# EAGLE design pm-batt-ti (EAGLE 6.4)

## Sheet 1 of 2
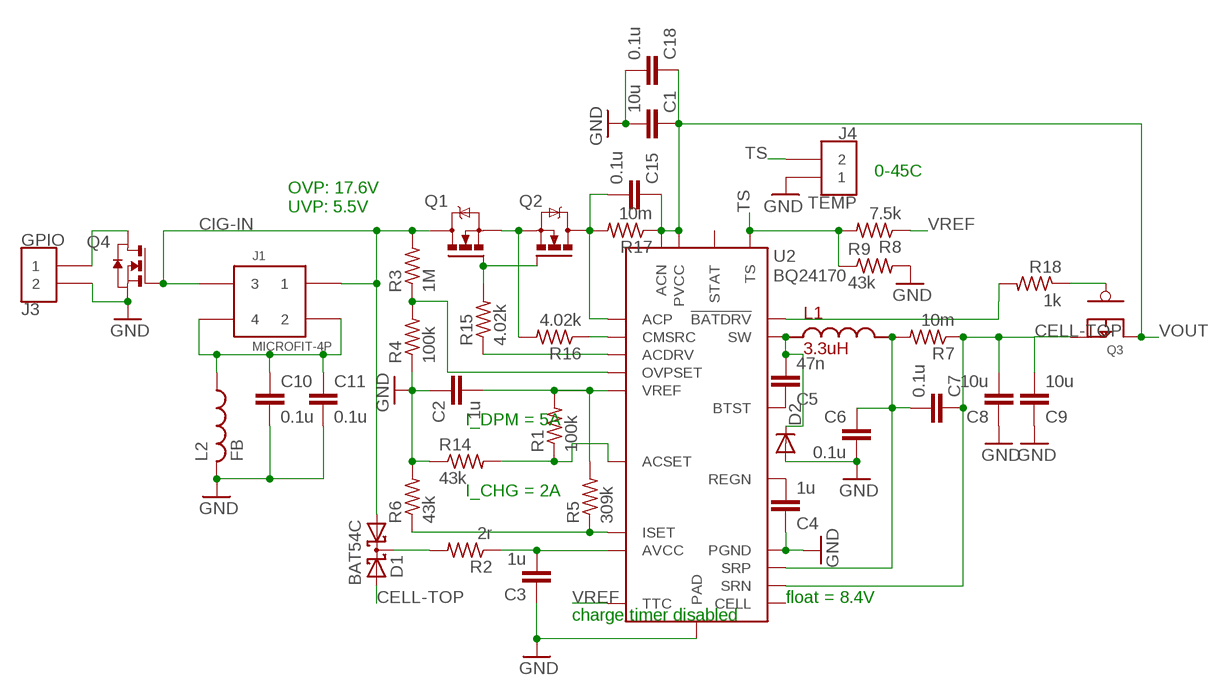
[diagram p0: schematic, sheet 1]

### Parts
C1  10u  C-EUC1206  [C1206]
C2  1u  C-EUC0603  [C0603]
C3  1u  C-EUC0603  [C0603]
C4  1u  C-EUC0603  [C0603]
C5  47n  C-EUC0603  [C0603]
C6  0.1u  C-EUC0603  [C0603]
C7  0.1u  C-EUC0603  [C0603]
C8  10u  C-EUC0805  [C0805]
C9  10u  C-EUC0805  [C0805]
C10  0.1u  C-EUC0603  [C0603]
C11  0.1u  C-EUC0603  [C0603]
C15  0.1u  C-EUC0603  [C0603]
C18  0.1u  C-EUC0603  [C0603]
D1  BAT54C  [SOT23]
D2  DIODESMA-ALT  [SMA-DIODE_ALT]
J1  MICROFIT-4P  [MICROFIT-4P]
J3  GPIO  MICROFIT-2P-RAPTH  [MICROFIT-2P]
J4  TEMP  MICROFIT-2P-RAPTH  [MICROFIT-2P]
L1  3.3uH  INDUCTORSVISHAY  [L-VISHAY-IHLP2020CZ01]
L2  FB  L-USL3216C  [L3216C]
Q1  FDB047N10  [D2_PAK]
Q2  FDB047N10  [D2_PAK]
Q3  SUM110P  [D2_PAK]
Q4  NMOSSOT23  [SOT-23]
R1  100k  R-US_R0603  [R0603]
R2  2r  R-US_R0603  [R0603]
R3  1M  R-US_R0603  [R0603]
R4  100k  R-US_R0603  [R0603]
R5  309k  R-US_R0603  [R0603]
R6  43k  R-US_R0603  [R0603]
R7  10m  R-US_R0805  [R0805]
R8  7.5k  R-US_R0603  [R0603]
R9  43k  R-US_R0603  [R0603]
R14  43k  R-US_R0603  [R0603]
R15  4.02k  R-US_R0603  [R0603]
R16  4.02k  R-US_R0603  [R0603]
R17  10m  R-US_R0805  [R0805]
R18  1k  R-US_R0603  [R0603]
U2  BQ24170  [QFN-24-TP]

### Nets
CELL-TOP: C7.1 C8.2 C9.2 D1.2(A2) Q3.3(S3) R7.1 U2.15(SRN) ; also sheet 2
CIG-IN: D1.1(A1) J1.1 J1.3 Q1.4(D) Q4.3(G) R3.2
GND: C1.2 C2.1 C3.1 C4.1 C6.2 C8.1 C9.1 C10.2 C11.2 C18.2 D2.A J3.P$2 J4.P$1 L2.2 Q4.2(S) R4.1 R6.2 R9.2 R14.1 U2.22(PGND) U2.23(PGND) U2.TP(PAD) ; also sheet 2
N$1: C15.2 Q2.4(D) R17.2 U2.6(ACP)
N$2: R3.1 R4.2 U2.18(OVPSET)
N$3: R1.1 R14.2 U2.17(ACSET)
N$5: C3.2 R2.1 U2.4(AVCC)
N$6: R5.1 R6.1 U2.13(ISET)
N$7: C4.2 U2.20(REGN)
N$8: C5.2 D2.C L1.P$1 U2.1(SW) U2.24(SW)
N$9: C5.1 U2.21(BTST)
N$10: C6.1 C7.2 L1.P$2 R7.2 U2.16(SRP)
N$11: D1.3(CC) R2.2
N$19: R18.2 U2.19(!BATDRV)
N$20: Q1.3(S) Q2.3(S) R16.2
N$21: Q3.1(G4) R18.1
N$24: Q1.1(G) Q2.1(G) R15.2
N$26: R15.1 U2.8(ACDRV)
N$27: R16.1 U2.7(CMSRC)
N$28: J3.P$1 Q4.1(D)
SHLD: C10.1 C11.1 J1.2 J1.4 L2.1
TS: J4.P$2 R8.2 R9.1 U2.10(TS)
VOUT: C1.1 C15.1 C18.1 Q3.4(D8) R17.1 U2.2(PVCC) U2.3(PVCC) U2.5(ACN) ; also sheet 2
VREF: C2.2 R1.2 R5.2 R8.1 U2.11(TTC) U2.12(VREF)
Unconnected: U2.9(STAT) U2.14(CELL)

### Notes on the sheet
- 0-45C
- OVP: 17.6V
  UVP: 5.5V
- I_DPM = 5A
- I_CHG = 2A
- float = 8.4V
- charge timer disabled

## Sheet 2 of 2
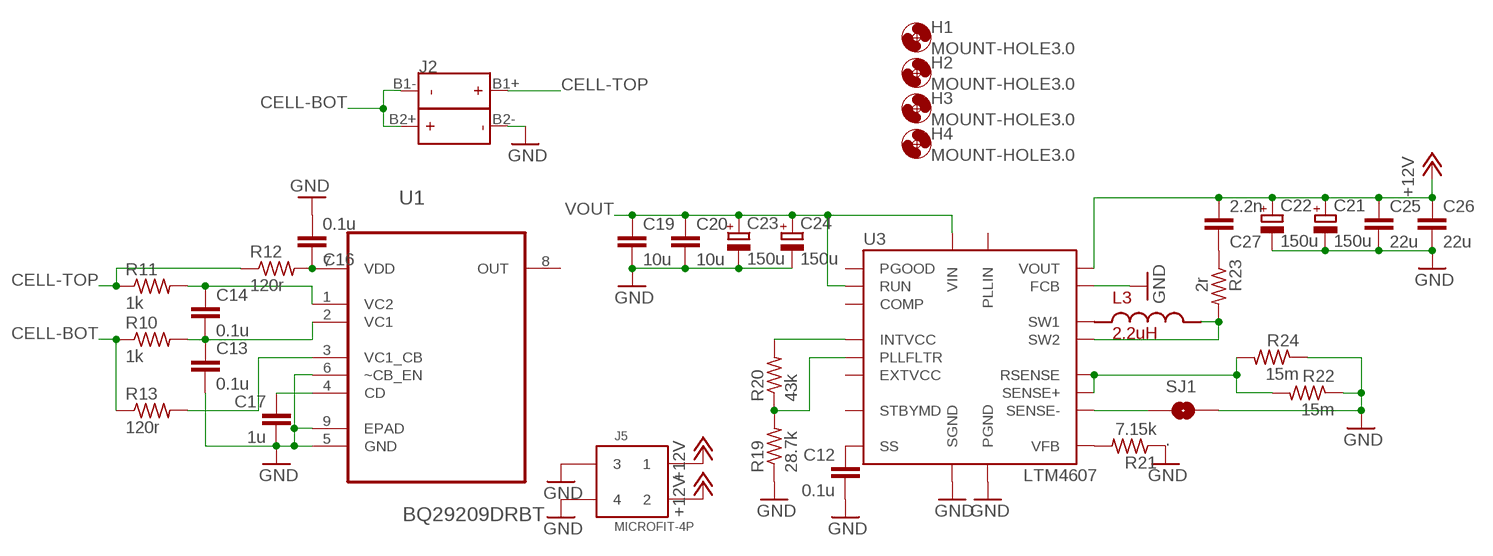
[diagram p1: schematic, sheet 2]

### Parts
C12  0.1u  C-EUC0805  [C0805]
C13  0.1u  C-EUC0603  [C0603]
C14  0.1u  C-EUC0603  [C0603]
C16  0.1u  C-EUC0603  [C0603]
C17  1u  C-EUC0603  [C0603]
C19  10u  C-EUC1206  [C1206]
C20  10u  C-EUC1206  [C1206]
C21  150u  CAP2917  [C2917]
C22  150u  CAP2917  [C2917]
C23  150u  CAP2917  [C2917]
C24  150u  CAP2917  [C2917]
C25  22u  C-EUC1206  [C1206]
C26  22u  C-EUC1206  [C1206]
C27  2.2n  C-EUC0603  [C0603]
H1  MOUNT-HOLE3.0  [3,0]
H2  MOUNT-HOLE3.0  [3,0]
H3  MOUNT-HOLE3.0  [3,0]
H4  MOUNT-HOLE3.0  [3,0]
J2  18650X2  [K1048]
J5  MICROFIT-4P  [MICROFIT-4P]
L3  2.2uH  INDUCTORSVISHAY  [L-VISHAY-IHLP2020CZ01]
R10  1k  R-US_R0603  [R0603]
R11  1k  R-US_R0603  [R0603]
R12  120r  R-US_R0603  [R0603]
R13  120r  R-US_R0603  [R0603]
R19  28.7k  R-US_R0603  [R0603]
R20  43k  R-US_R0603  [R0603]
R21  7.15k  R-US_R0603  [R0603]
R22  15m  R-US_R0805  [R0805@1]
R23  2r  R-US_R0603  [R0603]
R24  15m  R-US_R0805  [R0805@1]
SJ1  .  SOLDERJUMPERTRACE  [SJ_2S-TRACE]
U1  BQ29209DRBT  [SON65P315X315X100-9N]
U3  LTM4607  [LTM4607]

### Nets
+12V: C21.+ C22.+ C25.1 C26.1 C27.2 J5.1 J5.2 U3.E1(VOUT) U3.E2(VOUT) U3.F1(VOUT) U3.F2(VOUT) U3.F3(VOUT) U3.F4(VOUT) U3.G1(VOUT) U3.G2(VOUT) U3.G3(VOUT) U3.G4(VOUT) U3.H1(VOUT) U3.H2(VOUT) U3.H3(VOUT) U3.H4(VOUT)
CELL-BOT: J2.B1- J2.B2+ R10.1 R13.1
CELL-TOP: J2.B1+ R11.1 R12.1 ; also sheet 1
GND: C12.2 C13.2 C16.2 C17.2 C19.2 C20.2 C21.- C22.- C23.- C24.- C25.2 C26.2 J2.B2- J5.3 J5.4 R19.1 R21.1 R22.1 R24.1 SJ1.2 U1.5(GND) U1.6(~CB_EN) U1.9(EPAD) U3.A1(PGND) U3.A2(PGND) U3.A3(PGND) U3.A7(SGND) U3.A9(FCB) U3.A11(PGND) U3.A12(PGND) U3.B1(PGND) U3.B2(PGND) U3.B3(PGND) U3.B4(PGND) U3.B10(PGND) U3.B11(PGND) U3.B12(PGND) U3.C1(PGND) U3.C2(PGND) U3.C3(PGND) U3.C4(PGND) U3.C5(PGND) U3.C6(PGND) U3.C7(PGND) U3.C8(PGND) U3.C9(PGND) U3.C10(PGND) U3.C11(PGND) U3.C12(PGND) U3.D1(PGND) U3.D2(PGND) U3.D3(PGND) U3.D4(PGND) U3.D5(PGND) U3.D6(PGND) U3.D7(PGND) U3.D8(PGND) U3.D9(PGND) U3.D10(PGND) U3.D11(PGND) U3.D12(PGND) U3.E3(PGND) U3.E4(PGND) U3.E5(PGND) U3.E6(PGND) U3.E7(PGND) U3.E8(PGND) U3.E9(PGND) U3.E10(PGND) U3.E11(PGND) U3.E12(PGND) ; also sheet 1
N$4: C17.1 U1.4(CD)
N$12: R19.2 R20.1 U3.B8(PLLFLTR)
N$13: L3.P$1 U3.J1(SW1) U3.J2(SW1) U3.J3(SW1) U3.J4(SW1) U3.K1(SW1) U3.K2(SW1) U3.K3(SW1) U3.K4(SW1) U3.L1(SW1) U3.L2(SW1) U3.L3(SW1) U3.L4(SW1) U3.M1(SW1) U3.M2(SW1) U3.M3(SW1) U3.M4(SW1)
N$14: C13.1 C14.2 R10.2 U1.2(VC1)
N$15: C14.1 R11.2 U1.1(VC2)
N$16: R20.2 U3.F5(INTVCC)
N$17: C16.1 R12.2 U1.7(VDD)
N$18: R13.2 U1.3(VC1_CB)
N$22: C12.1 U3.A6(SS)
N$23: R21.2 U3.B6(VFB)
N$25: C27.1 R23.1
N$34: SJ1.1 U3.A5(SENSE-)
RSENSE: R22.2 R24.2 U3.A4(SENSE+) U3.F10(RSENSE) U3.F11(RSENSE) U3.F12(RSENSE) U3.G5(RSENSE) U3.G6(RSENSE) U3.G7(RSENSE) U3.G8(RSENSE) U3.G9(RSENSE) U3.G10(RSENSE) U3.G11(RSENSE) U3.G12(RSENSE) U3.H5(RSENSE) U3.H6(RSENSE) U3.H7(RSENSE) U3.H8(RSENSE) U3.H9(RSENSE) U3.H10(RSENSE) U3.H11(RSENSE) U3.H12(RSENSE) U3.J5(RSENSE) U3.J6(RSENSE) U3.J7(RSENSE) U3.K5(RSENSE) U3.K6(RSENSE) U3.L5(RSENSE) U3.L6(RSENSE) U3.M5(RSENSE) U3.M6(RSENSE)
SW2: L3.P$2 R23.2 U3.J8(SW2) U3.J9(SW2) U3.K7(SW2) U3.K8(SW2) U3.K9(SW2) U3.L7(SW2) U3.L8(SW2) U3.L9(SW2) U3.M7(SW2) U3.M8(SW2) U3.M9(SW2)
VOUT: C19.1 C20.1 C23.+ C24.+ U3.A8(RUN) U3.J10(VIN) U3.J11(VIN) U3.J12(VIN) U3.K10(VIN) U3.K11(VIN) U3.K12(VIN) U3.L10(VIN) U3.L11(VIN) U3.L12(VIN) U3.M10(VIN) U3.M11(VIN) U3.M12(VIN) ; also sheet 1
Unconnected: U1.8(OUT) U3.A10(STBYMD) U3.B5(PGOOD) U3.B7(COMP) U3.B9(PLLIN) U3.F6(EXTVCC)

## Library data of the parts
C1-C11 C13-C20 C25-C27 = rcl:C-EU: CAPACITOR, European symbol
C12 = resistor:C-EU: CAPACITOR, European symbol
C21-C24 = Neel:CAP
D1 = diode:BAT54C: Schottky Diodes Source: Fairchild .. BAT54.pdf
D2 = SparkFun-DiscreteSemi:DIODE: Diode These are standard reverse protection diodes and small signal diodes. SMA package can handle up to about 1A. SOD-323 can handle about 200mA. What the SOD-323 package when ordering, there are some mfgs out there that are 5-pin packages.
H1-H4 = holes:MOUNT-HOLE: MOUNTING HOLE with drill center marker
J1 J5 = earthmine:MICROFIT-4P: Molex Micro-Fit 3.0 Vertical Header - 4 Position
J2 = Neel:18650X2
J3 J4 = earthmine:MICROFIT-2P-RA: Molex Microfit 3.0 Series - 2P Right Angle Header
L1 L3 = Neel:INDUCTORS
L2 = rcl:L-US: INDUCTOR, American symbol
Q1 Q2 = earthmine:FDB047N10: N-Channel PowerTrench MOSFET
Q3 = earthmine:SUM110P
Q4 = zetex:NMOSSOT23: MOS FET; OC_FARNELL: unknown; OC_NEWARK: unknown
R1-R21 R23 = resistor:R-US_: RESISTOR, American symbol
R22 R24 = rcl:R-US_: RESISTOR, American symbol
SJ1 = SparkFun-Passives:SOLDERJUMPER: Solder Jumper Standard SMD solder jumper. Used to automate production. Two varients : Normally Open and Normally Closed are the same, but have different paste layers. NC will have a large amount of paste and should jumper during reflow.
U1 = Texas Instruments_By_element14_Batch_1:BQ29209DRBT: Voltage Protection with Automatic Cell Balance for 2-Series Cell Li-Ion Batteries; MPN: BQ29209DRBT; OC_FARNELL: -; OC_NEWARK: 83R9422; PACKAGE: SON-8; SUPPLIER: Texas Instruments
U2 = Neel:BQ24170
U3 = earthmine:LTM4607

## Board
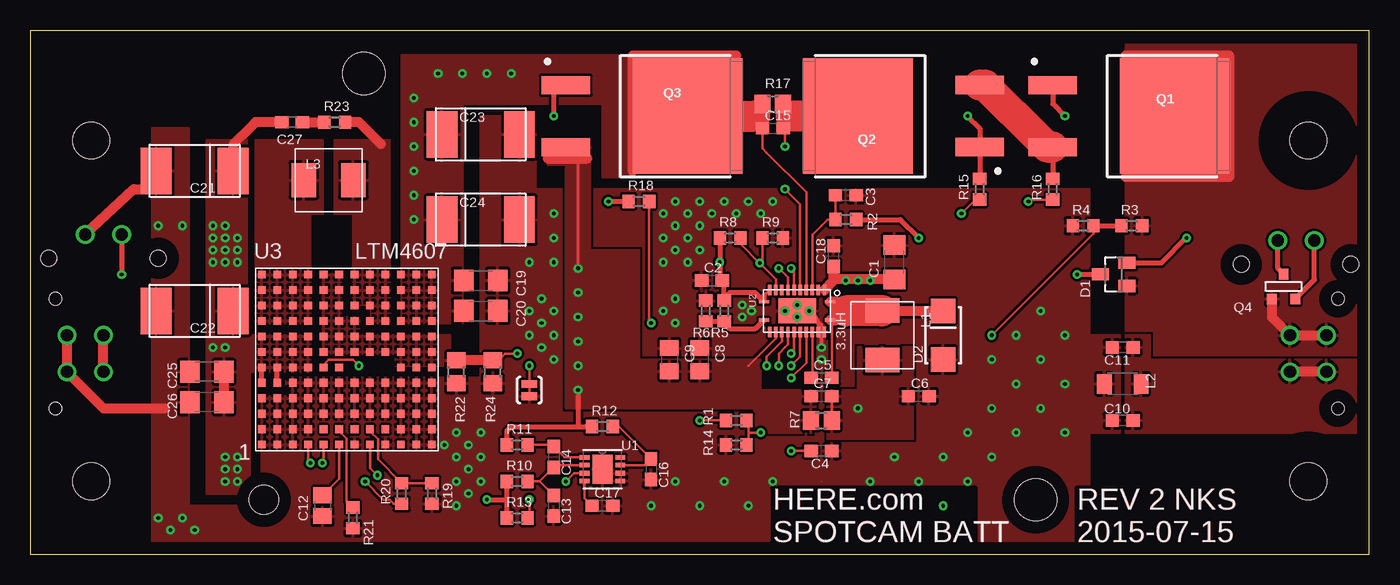
[diagram p2: board, top side]
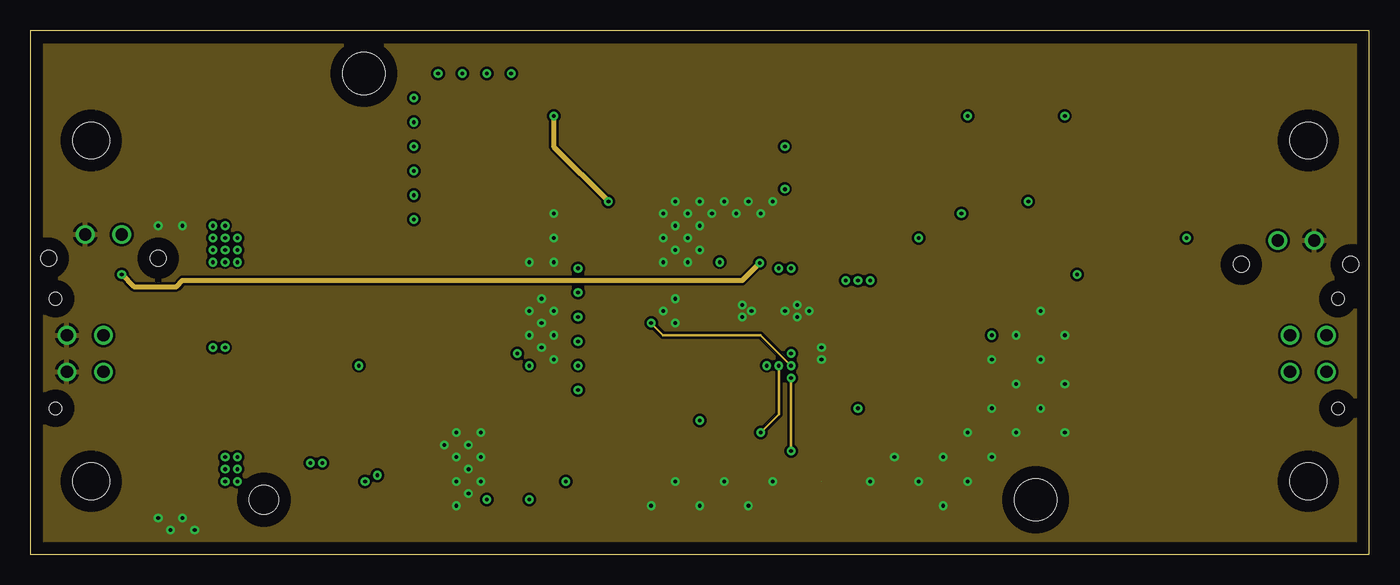
[diagram p3: board, inner layer Route2]
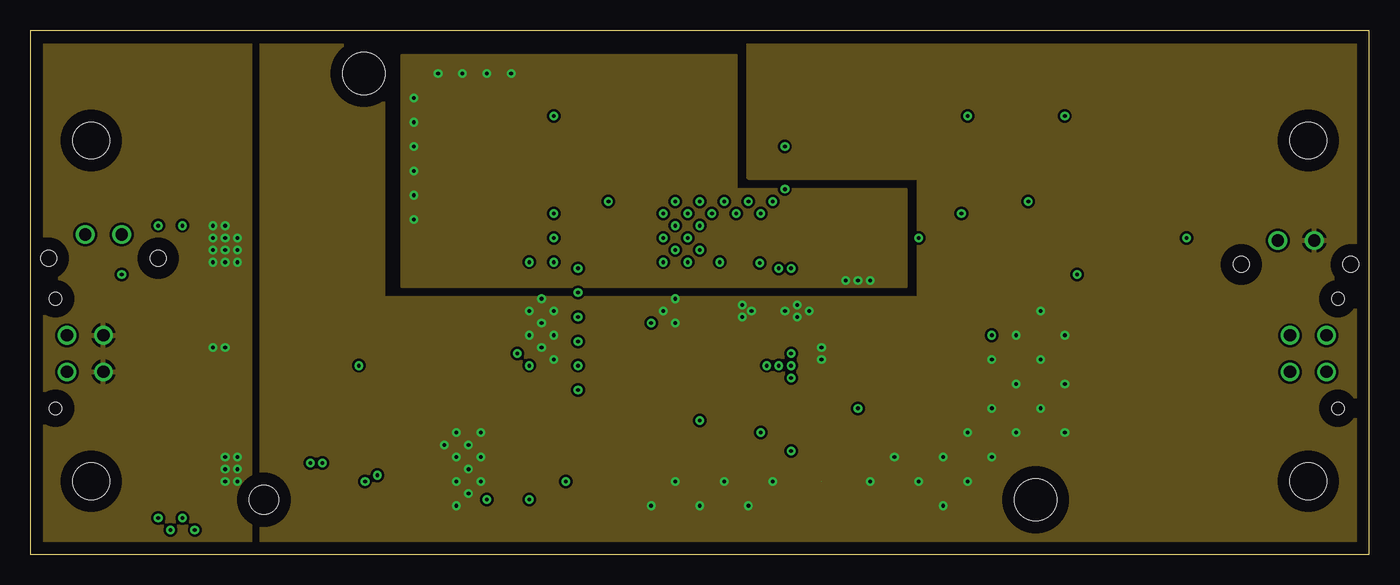
[diagram p4: board, inner layer Route15]
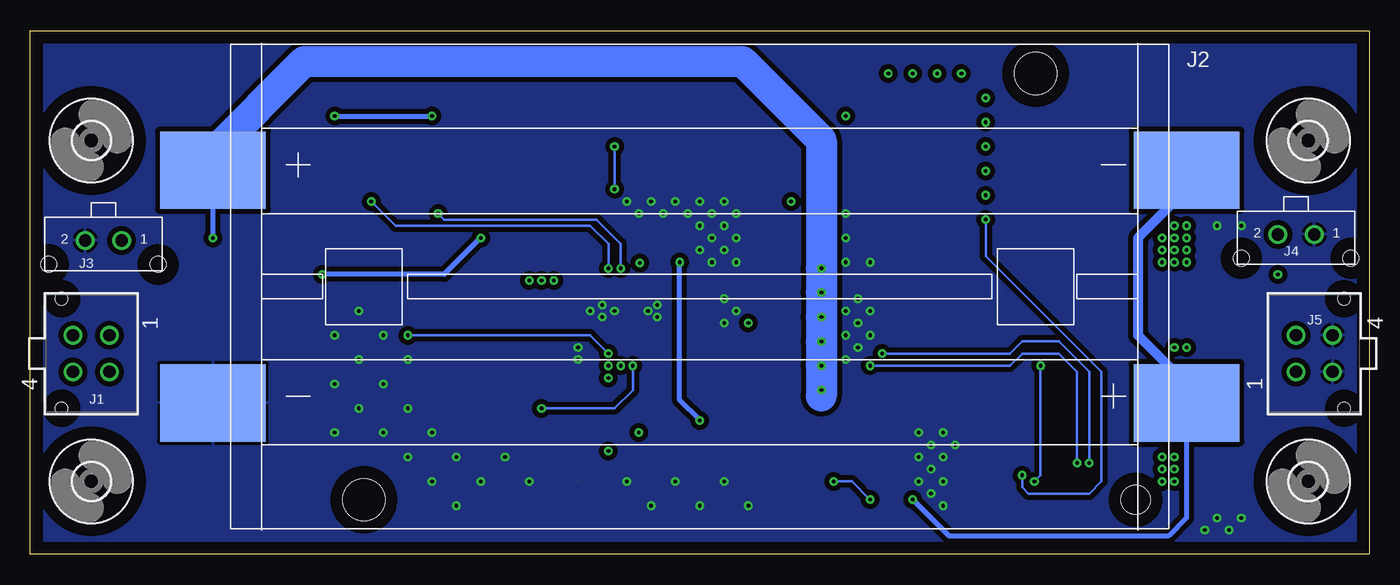
[diagram p5: board, bottom side, seen from below]

Size 110 x 43 mm. Coordinates in mm from the lower left corner, seen from the top.
Outline: 0,0 110,0 110,43 0,43 0,0
Copper layers (1+2*15+16): Top 0.07mm / dielectric 0.7mm / Route2 0.07mm / dielectric 0.7mm / Route15 0.07mm / dielectric 0.7mm / Bottom 0.07mm
Design rules "default *": minimum track width 5mil, minimum drill 8mil, track to track 8mil, track to pad 8mil, pad to pad 8mil, via to via 8mil, smd to smd 8mil, copper to edge 40mil, drill to drill 8mil, minimum pad ring 10mil, minimum via ring 8mil, stop-mask expansion 4mil, vias tented up to drill 0mil, thermal gap 10mil

### Footprints (pad centres in the part's own frame; a part is rotated, then mirrored left to right if it is on the bottom)
C1206 = smd 1.6 x 1.8: 1 -1.4,0; 2 1.4,0
C0603 = smd 1.1 x 1: 1 -0.85,0; 2 0.85,0
C0805 = smd 1.3 x 1.5: 1 -0.95,0; 2 0.95,0
C0805' = smd 1.3 x 1.5: 1 -0.85,0; 2 0.85,0
C2917 = smd 2.54 x 3.81: + -3.175,0; - 3.175,0
SOT23 = smd 1 x 1.4: 1 -0.95,-1.1; 2 0.95,-1.1; 3 0,1.1
SMA-DIODE_ALT = smd 2 x 2: A -2,0; C 2,0
3,0 = hole 3: 0,0
MICROFIT-4P = drill 1.016: 1 1.5,-1.5; 2 -1.5,-1.5; 3 1.5,1.5; 4 -1.5,1.5 | hole 1.016: -4.5,2.44; 4.5,2.44
K1048 = smd 8.68 x 6.35: B1+ -40,9.555; B1- 40,9.555; B2+ 40,-9.555; B2- -40,-9.555 | hole 3.45: -27.6,-17.505; 27.6,17.505 | hole 2.39: 35.82,-17.505
MICROFIT-2P = drill 1.02: P$1 1.5,0.285; P$2 -1.5,0.285 | hole 1.3: 4.5,-1.675; -4.5,-1.675
L-VISHAY-IHLP2020CZ01 = smd 2.032 x 2.794: P$1 -2.032,0; P$2 2.032,0
L3216C = smd 1.2 x 1.6: 1 -1.5,0; 2 1.5,0
D2_PAK = smd 1.5 x 4: 1 -2.54,-10; 3 2.55,-10 | smd 9.5 x 9: 4 0,0
SOT-23 = smd 0.787 x 0.889: 1 0.025,-1.016; 2 -0.94,1.016; 3 0.991,1.016
R0603 = smd 1 x 1.1: 1 -0.85,0; 2 0.85,0
R0805 = smd 1.3 x 1.5: 1 -0.85,0; 2 0.85,0
R0805' = smd 1.3 x 1.5: 1 -0.95,0; 2 0.95,0
SJ_2S-TRACE = smd 0.635 x 1.27: 1 -0.508,0; 2 0.508,0
SON65P315X315X100-9N = smd 0.813 x 0.381: 1 -1.473,0.965; 2 -1.473,0.33; 3 -1.473,-0.33; 4 -1.473,-0.965; 5 1.473,-0.965; 6 1.473,-0.33; 7 1.473,0.33; 8 1.473,0.965 | smd 1.651 x 2.388: 9 0,0
QFN-24-TP = smd 0.85 x 0.28: 1 -2.725,-0.75; 12 2.725,-0.75; 13 2.725,0.75; 24 -2.725,0.75 | smd 0.28 x 0.85: 2 -2.25,-1.725; 3 -1.75,-1.725; 4 -1.25,-1.725; 5 -0.75,-1.725; 6 -0.25,-1.725; 7 0.25,-1.725; 8 0.75,-1.725; 9 1.25,-1.725; 10 1.75,-1.725; 11 2.25,-1.725; 14 2.25,1.725; 15 1.75,1.725; 16 1.25,1.725; 17 0.75,1.725; 18 0.25,1.725; 19 -0.25,1.725; 20 -0.75,1.725; 21 -1.25,1.725; 22 -1.75,1.725; 23 -2.25,1.725 | smd 3.1 x 2.05: TP 0,0
LTM4607 = smd 0.63 x 0.63: A1 -6.985,-6.985; A2 -5.715,-6.985; A3 -4.445,-6.985; A4 -3.175,-6.985; A5 -1.905,-6.985; A6 -0.635,-6.985; A7 0.635,-6.985; A8 1.905,-6.985; A9 3.175,-6.985; A10 4.445,-6.985; A11 5.715,-6.985; A12 6.985,-6.985; B1 -6.985,-5.715; B2 -5.715,-5.715; B3 -4.445,-5.715; B4 -3.175,-5.715; B5 -1.905,-5.715; B6 -0.635,-5.715; B7 0.635,-5.715; B8 1.905,-5.715; B9 3.175,-5.715; B10 4.445,-5.715; B11 5.715,-5.715; B12 6.985,-5.715; C1 -6.985,-4.445; C2 -5.715,-4.445; C3 -4.445,-4.445; C4 -3.175,-4.445; C5 -1.905,-4.445; C6 -0.635,-4.445; C7 0.635,-4.445; C8 1.905,-4.445; C9 3.175,-4.445; C10 4.445,-4.445; C11 5.715,-4.445; C12 6.985,-4.445; D1 -6.985,-3.175; D2 -5.715,-3.175; D3 -4.445,-3.175; D4 -3.175,-3.175; D5 -1.905,-3.175; D6 -0.635,-3.175; D7 0.635,-3.175; D8 1.905,-3.175; D9 3.175,-3.175; D10 4.445,-3.175; D11 5.715,-3.175; D12 6.985,-3.175; E1 -6.985,-1.905; E2 -5.715,-1.905; E3 -4.445,-1.905; E4 -3.175,-1.905; E5 -1.905,-1.905; E6 -0.635,-1.905; E7 0.635,-1.905; E8 1.905,-1.905; E9 3.175,-1.905; E10 4.445,-1.905; E11 5.715,-1.905; E12 6.985,-1.905; F1 -6.985,-0.635; F2 -5.715,-0.635; F3 -4.445,-0.635; F4 -3.175,-0.635; F5 -1.905,-0.635; F6 -0.635,-0.635; F10 4.445,-0.635; F11 5.715,-0.635; F12 6.985,-0.635; G1 -6.985,0.635; G2 -5.715,0.635; G3 -4.445,0.635; G4 -3.175,0.635; G5 -1.905,0.635; G6 -0.635,0.635; G7 0.635,0.635; G8 1.905,0.635; G9 3.175,0.635; G10 4.445,0.635; G11 5.715,0.635; G12 6.985,0.635; H1 -6.985,1.905; H2 -5.715,1.905; H3 -4.445,1.905; H4 -3.175,1.905; H5 -1.905,1.905; H6 -0.635,1.905; H7 0.635,1.905; H8 1.905,1.905; H9 3.175,1.905; H10 4.445,1.905; H11 5.715,1.905; H12 6.985,1.905; J1 -6.985,3.175; J2 -5.715,3.175; J3 -4.445,3.175; J4 -3.175,3.175; J5 -1.905,3.175; J6 -0.635,3.175; J7 0.635,3.175; J8 1.905,3.175; J9 3.175,3.175; J10 4.445,3.175; J11 5.715,3.175; J12 6.985,3.175; K1 -6.985,4.445; K2 -5.715,4.445; K3 -4.445,4.445; K4 -3.175,4.445; K5 -1.905,4.445; K6 -0.635,4.445; K7 0.635,4.445; K8 1.905,4.445; K9 3.175,4.445; K10 4.445,4.445; K11 5.715,4.445; K12 6.985,4.445; L1 -6.985,5.715; L2 -5.715,5.715; L3 -4.445,5.715; L4 -3.175,5.715; L5 -1.905,5.715; L6 -0.635,5.715; L7 0.635,5.715; L8 1.905,5.715; L9 3.175,5.715; L10 4.445,5.715; L11 5.715,5.715; L12 6.985,5.715; M1 -6.985,6.985; M2 -5.715,6.985; M3 -4.445,6.985; M4 -3.175,6.985; M5 -1.905,6.985; M6 -0.635,6.985; M7 0.635,6.985; M8 1.905,6.985; M9 3.175,6.985; M10 4.445,6.985; M11 5.715,6.985; M12 6.985,6.985

### Placement (x,y rotation side)
C1  71,24 90 top
C2  56,22.5 0 top
C3  67,29.5 180 top
C4  65,8.5 180 top
C5  65,14.5 0 top
C6  73,13 0 top
C7  65,13 0 top
C8  55,16 270 top
C9  52.5,16 270 top
C10  89.75,11 180 top
C11  89.75,17 180 top
C12  0.1u  [C0805']  24,4 270 top
C13  43,4 270 top
C14  43,8 270 top
C15  61,35 0 top
C16  51,7 270 top
C17  47,4 0 top
C18  66,24.5 90 top
C19  37,22.5 0 top
C20  37,20 0 top
C21  13.5,31.5 180 top
C22  13.5,20 180 top
C23  37,34.5 0 top
C24  37,27.5 0 top
C25  14.5,15 180 top
C26  14.5,12.5 180 top
C27  21.5,35.5 180 top
D1  89,23 90 top
D2  75,18 90 top
H1  105,34 0 bottom
H2  105,6 0 bottom
H3  5,34 0 bottom
H4  5,6 0 bottom
J1  105,16.5 90 bottom
J2  55,22 0 bottom
J3  104,25.5 0 bottom
J4  6,26 0 bottom
J5  4.5,16.5 270 bottom
L1  70,18 270 top
L2  89.75,14 180 top
L3  24.5,30.75 0 top
Q1  94,36 270 top
Q2  68,36 90 top
Q3  54,36 270 top
Q4  103,22 180 top
R1  58,11 180 top
R2  67,27.5 0 top
R3  90.5,27 0 top
R4  86.5,27 0 top
R5  57,20 90 top
R6  55.5,20 90 top
R7  65,11 0 top
R8  57.5,26 0 top
R9  61,26 0 top
R10  40,6 0 top
R11  40,9 0 top
R12  47,10.5 0 top
R13  40,3 0 top
R14  58,9 0 top
R15  78,30 90 top
R16  84,30 90 top
R17  61,37 0 top
R18  50,29 0 top
R19  33,5 90 top
R20  30.5,5 270 top
R21  26.5,3 90 top
R22  15m  [R0805']  35,15 90 top
R23  25,35.5 0 top
R24  15m  [R0805']  38,15 90 top
SJ1  41,13.5 270 top
U1  47,7 0 top
U2  63,20 180 top
U3  26,16 0 top

### Tracks (layer width: path | path; a pad name or v marks a point on that pad's centre or on a via)
+12V  (via drill 0.3)
  Top 0.406: U3.E2 U3.F2 | U3.E1 U3.F1
  Top 0.813: J5.1 J5.2 | C27.2 18.5,35.5 18,35 16.68,33.67 C21.+ | C26.1 C25.1
  other vias: 16,27 15,27 15,26 16,26 17,26 17,25 16,25 15,25 15,24 16,24 17,24 15,17 16,17 16,8 16,7 16,6 17,6 17,7 17,8
  pour Top (isolate 0.406): 14.5,34 14.5,5 18,5 18,15 23,15 23,18 17.75,18 17.75,34
  pour Route15: 1,42 18,42 18,1 1,1
CELL-BOT  (via drill 0.3)
  Top 0.406: R13.1 39.15,4.5 | 39.15,4.5 R10.1 | v37.5,4.5 39.15,4.5
  Bottom 0.406: J2.B2+ 15,3 16.5,1.5 34.5,1.5 v37.5,4.5
  Bottom 0.813: J2.B1- 15,30 19,26 19,18 15,14 J2.B2+
CELL-TOP  (via drill 0.3)
  Top 0.203: U2.15 61.25,17.75 59,15.5 | 45,33 v45,23.5
  Top 0.406: R11.1 39.15,10.15 39.5,10.5 45,10.5 | 45,10.5 45.65,10.5 R12.1 | D1.2 92.95,23.95 v95,26 | 45,13 45,10.5
  Top 0.813: 42.5,32.5 45.75,32.5 45.5,32.5 45,33
  Bottom 0.406: v95,26 J2.B1+
  Bottom 2.54: J2.B1+ 95,33 87.5,40.5 51.5,40.5 45,34 v45,23.5 v45,21.5 v45,19.5 v45,17.5 v45,15.5 45,13
  other vias: 45,13.5
  pour Top: 44,32 44,12 59.5,12 59.5,10 64.5,10 64.5,13.5 60,13.5 60,16 50,16 50,25 46,25 46,34 42.5,34 42.5,32
CIG-IN
  Top 0.813: Q4.3 102.01,19.49 J1.1 J1.3 | 90,31 98.5,31 98.5,41 90,41 90,40 Q1.4
  pour Top (rank 2): 90,42 109,42 109,16 90,16
GND  (via drill 0.3)  (1 unrouted)
  Top 0.3: 65,18.9 65,18.5 v65,17
  Top 0.406: Q4.2 105.5,22.54 J3.P$2 | 65,18.5 64.5,19.5
  Top 0.813: J5.4 J5.3 6,12 11,12 | J4.P$1 8.5,30 11,30
  other vias: 58.5,20.5 58.5,19.5 59.25,20 65,16 62,20 64,20 63,19.5 63,20.5 52,28 54,28 56,28 58,28 60,28 53,29 55,29 57,29 59,29 61,29 53,27 54,26 52,26 53,25 52,24 53,21 52,20 53,19 54,24 55,25 55,27 43,28 43,26 43,24 41,24 42,21 41,20 43,20 42,19 41,18 43,18 42,17 43,16 35,10 37,10 36,9 34,9 35,8 37,8 36,7 35,6 37,6 36,5 35,4 10.5,27 12.5,27 10.5,3 12.5,3 11.5,2 13.5,2 51,4 55,4 59,4 71,8 75,4 53,6 57,6 61,6 69,6 73,6 77,6 75,8 77,10 79,12 79,8 81,10 83,12 85,10 81,14 79,16 83,16 85,14 81,18 85,18 83,20
  pour Top (rank 2): 37,14.5 37,36 41.5,36 41.5,30 87,30 87,18 89.5,18 89.5,10 87,10 87,1 10,1 10,35 13,35 13,4 19,4 19,13 21,13 21,14.5
  pour Bottom (isolate 0.406): 109,42 109,1 1,1 1,42
  pour Route2: 1,42 1,1 109,1 109,42
  pour Route15: 19,42 19,1 109,1 109,42 59,42 59,31 73,31 73,21 29,21 29,42
N$1  (via drill 0.3)
  Top 0.203: U2.6 63.25,28.75 v62,30 | v62,33.5 62,34.85 C15.2
  Top 0.813: R17.2 62,37 62.5,36 62.85,36 C15.2
  Top 2.54: Q2.4 67,36 62.5,36
  Bottom 0.203: v62,30 v62,33.5
N$2  (via drill 0.3)
  Top 0.203: U2.18 62.75,16.75 v62.5,16.5 | R4.2 87.35,26.35 v79,18
  Top 0.406: R4.2 R3.1
  Bottom 0.203: v79,18 64,18 v62.5,16.5
N$3  (via drill 0.3)
  Top 0.203: U2.17 62.25,17.25 62,17 61.5,16.5 v61.5,15.5 | v60,10 59,10 | 59,10 59,10.85 R1.1 | R14.2 59,9.15 59,10
  Route2 0.203: v61.5,15.5 61.5,11.5 v60,10
N$4
  Top 0.203: U1.4 45.53,4.62 C17.1
N$5
  Top 0.203: U2.4 64.25,26.25 65,27 65.5,27.5 R2.1 C3.2
N$6
  Top 0.406: R6.1 R5.1 57,19 57.5,18.5 59.52,18.5 U2.13
N$7  (via drill 0.3)
  Top 0.203: U2.20 63.75,15.75 v62.5,14.5 | v62.5,8.5 C4.2
  Route2 0.203: v62.5,14.5 v62.5,8.5
N$8
  Top 0.203: C5.2 65.85,19.12 U2.24
  Top 0.813: U2.1 66.25,20.75 67,20 66.25,19.25 U2.24 | L1.P$1 74.97,20.03 D2.C
  Top 2.54: L1.P$1 69.97,20 67,20
N$9
  Top 0.203: U2.21 64.25,14.6 C5.1
N$10  (via drill 0.3)
  Top 0.203: 65.75,13.1 C7.2 65.85,11.1 R7.2 | U2.16 61.75,17.5 60.5,16.25 v60.5,15.5
  Bottom 0.203: v60.5,15.5 60.5,13.5 62,12 v68,12
  pour Top: 72.5,17 68,17 68,13.5 65.5,13.5 65.5,9.5 72.5,9.5
N$11  (via drill 0.3)
  Top 0.406: R2.2 71.5,27.5 v73,26 | v86,23 D1.3
  Bottom 0.406: v73,26 76,23 v86,23
N$12
  Top 0.203: R19.2 R20.1 28.55,7.8 28.55,9.45 27.91,10.1 U3.B8
N$13
  pour Top: 23,19 18.5,19 18.5,34 24,34 24,28 23,28
N$14
  Top 0.203: U1.2 43.18,7.33 C14.2 41.85,6 | 41.85,6 R10.2 41.85,6 | C13.1 41.85,6
N$15
  Top 0.203: R11.2 42.85,9 C14.1 43.88,7.96 U1.1
N$16  (via drill 0.3)
  Top 0.203: U3.F5 24.09,15.6 24.5,16 26.5,16 v27,15.5 | 30.35,4 R20.2 29.85,4.15 29.5,4.5 29,4.5 v27.5,6
  Bottom 0.203: v27,15.5 27,6.5 v27.5,6
N$17
  Top 0.203: U1.7 50.48,7.33 C16.1 48.35,10.5 R12.2
N$18  (via drill 0.3)
  Top 0.203: U1.3 44.67,6.67 v44,6 | v41,4.5 41,3.15 R13.2
  Bottom 0.203: v44,6 42.5,6 v41,4.5
N$19  (via drill 0.3)
  Top 0.203: U2.19 63.25,16.25 v62.5,15.5 | R18.2 50.85,19.15 v51,19
  Route2 0.203: v51,19 52,18 60,18 v62.5,15.5
N$20
  Top 0.406: Q1.3 R16.2
  Top 2.54: Q2.3 78.45,38.55 83,34 83.55,33.45 Q1.3
N$21  (via drill 0.3)
  Top 0.406: Q3.1 43,38.54 v43,36 | v47.5,29 R18.1
  Route2 0.406: v43,36 43,33.5 v47.5,29
N$22
  Top 0.203: U3.A6 25.36,6.21 C12.1
N$23
  Top 0.203: U3.B6 25.36,10.13 26,9.5 26,4.35 R21.2
N$24  (via drill 0.3)
  Top 0.406: R15.2 Q2.1 78,35 v77,36 | Q1.1 84,37 v85,36
  Bottom 0.406: v85,36 v77,36
N$25
  Top 0.813: C27.1 R23.1
N$26  (via drill 0.3)
  Top 0.203: U2.8 62.25,22.75 v61.5,23.5 | v76.5,28 77.65,29.15 R15.1
  Bottom 0.203: v61.5,23.5 61.5,25.5 63.5,27.5 76,27.5 v76.5,28
N$27  (via drill 0.3)
  Top 0.203: U2.7 62.75,23.25 v62.5,23.5 | v82,29 82.15,29.15 R16.1
  Bottom 0.203: v62.5,23.5 62.5,25.5 64,27 80,27 v82,29
N$28
  Top 0.406: Q4.1 102.5,23.49 J3.P$1
N$34  (via drill 0.3)
  Top 0.203: U3.A5 24.09,7.59 v24,7.5 | v41,15.5 SJ1.1
  Bottom 0.203: v24,7.5 24,15 25.5,16.5 28.5,16.5 29.5,15.5 39,15.5 39.5,15.5 v41,15.5
RSENSE  (via drill 0.3)
  Top 0.203: U3.A4 22.82,7.67 v23,7.5 | v40,16.5 39,16.5 38.5,16 38.05,16 R24.2
  Top 0.813: R24.2 R22.2
  Bottom 0.203: v23,7.5 23,15 25.5,17.5 28.5,17.5 29.5,16.5 v40,16.5
  pour Top: 24,23 25.5,23 25.5,19.5 27,19.5 27,18 34.5,18 34.5,15.5 30,15.5 30,16.5 24,16.5
SHLD
  Top 0.813: J1.4 J1.2
  pour Top: 90,18 90,10 109,10 109,16 92,16 92,18
SW2
  Top 0.813: R23.2 27,35.5 28.8,33.7
  pour Top: 26.5,20.5 28,20.5 28,19 29.5,19 29.5,34 25,34 25,28 26.5,28
TS  (via drill 0.3)
  Top 0.203: U2.10 61.25,22.6 60.17,23.68 | R9.1 60.15,23.7 60.17,23.68 | 60.17,23.68 v59.92,23.93 58.35,25.5 R8.2
  Top 0.406: J4.P$2 v7.5,23
  Route2 0.406: v7.5,23 8.5,22 12,22 12.5,22.5 58.5,22.5 v59.92,23.93
VOUT  (via drill 0.3)
  Top 0.203: U3.A8 27.91,7.09 v28.5,6.5 | U2.2 U2.3 | U2.5 63.75,29.75 60.5,33 60.15,33.35 C15.1 | 66.1,22.6 66.9,22.6 v67,22.5
  Top 0.406: 60,37 58,37 57,36 57,41
  Top 0.813: R17.1 60,37 59.5,36 59.15,36 C15.1 | 49.5,31.5 49.5,41 57,41 58,41 | U2.2 65.25,21.75 66,22.5 | 66,22.5 C18.1 | C1.1 66.1,22.6 66,22.5
  Top 2.54: Q3.4 57,36 59.5,36
  Bottom 0.203: v28.5,6.5 28.5,5.5 28,5 23,5 22,6 22,15 26,19 31.5,24.5 31.5,25 v31.5,27.5
  other vias: 69,22.5 68,22.5 33.5,39.5 35.5,39.5 37.5,39.5 39.5,39.5 31.5,37.5 31.5,35.5 31.5,33.5 31.5,31.5 31.5,29.5
  pour Top: 35.5,19 30.5,19 30.5,41 51,41 51,31 47,31 47,37 35.5,37
  pour Route15: 31,41 58,41 58,30 72,30 72,22 30.5,22 30.5,41
VREF  (via drill 0.3)
  Top 0.203: 56.65,22.7 C2.2 | R1.2 v55,11
  Top 0.305: 60.27,21.25 U2.11
  Top 0.406: 57,21 R5.2 57,21 | 57,21 57,22.35 C2.2 | 60.27,21.25 U2.12 59.52,21.5 59.5,21.5 57.5,21.5 57,21 | R8.1 v56.65,24 56.65,22.7
  Bottom 0.406: v55,11 56.65,12.65 v56.65,24

### Text on the board
Top: HERE.com / SPOTCAM BATT | REV 2 NKS / 2015-07-15
tPlace: HERE.com / SPOTCAM BATT | REV 2 NKS / 2015-07-15